# Altium schematic sheet 02_CPU+Connect.SchDoc
size A4; SheetNumber: 3; SheetTotal: 4
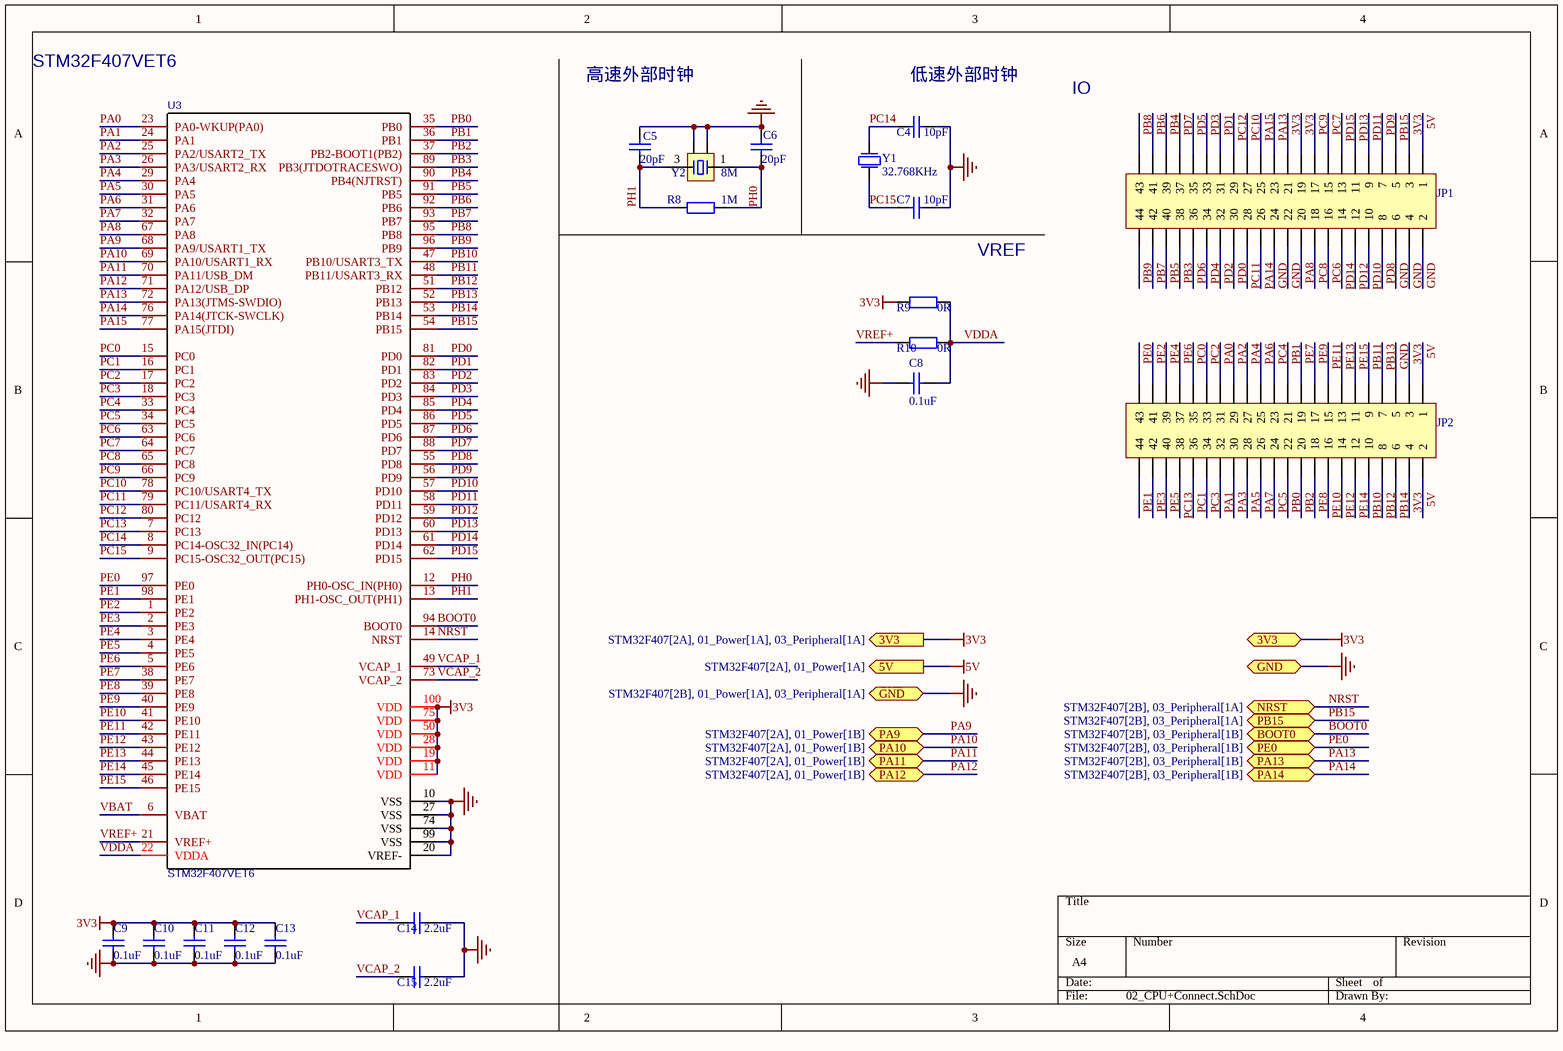
[diagram p0: 02_CPU+Connect.SchDoc]

## Parts
C4  10pF  [C 0402_L]
C5  20pF  [C 0402_L]
C6  20pF  [C 0402_L]
C7  10pF  [C 0402_L]
C8  0.1uF  [C 0402_L]
C9  0.1uF  [C 0402_L]
C10  0.1uF  [C 0402_L]
C11  0.1uF  [C 0402_L]
C12  0.1uF  [C 0402_L]
C13  0.1uF  [C 0402_L]
C14  2.2uF  [C 0402_L]
C15  2.2uF  [C 0402_L]
JP1  Header 2x22  [HDR2.54-LI-2x22P]  (value not drawn)
JP2  Header 2x22  [HDR2.54-LI-2x22P]  (value not drawn)
R8  1M  [R 0402_L]
R9  0R  [R 0402_L]
R10  0R  [R 0402_L]
U3  STM32F407VET6  [LQFP100 14x14_N]
Y1  32.768KHz  [FC135-3.2X1.5]
Y2  8M  [OSC 3225-4P]

## Ports
3V3 (bidir, see STM32F407[2A], 01_Power[1A], 03_Peripheral[1A]), 3V3 (out, see STM32F407[2A], 01_Power[1A], 03_Peripheral[1A]), 5V (out, see STM32F407[2A], 01_Power[1A]), BOOT0 (bidir, see STM32F407[2B], 03_Peripheral[1B]), GND (bidir, see STM32F407[2B], 01_Power[1A], 03_Peripheral[1A]), NRST (bidir, see STM32F407[2B], 03_Peripheral[1A]), PA9 (bidir, see STM32F407[2A], 01_Power[1B]), PA10 (bidir, see STM32F407[2A], 01_Power[1B]), PA11 (bidir, see STM32F407[2A], 01_Power[1B]), PA12 (bidir, see STM32F407[2A], 01_Power[1B]), PA13 (bidir, see STM32F407[2B], 03_Peripheral[1B]), PA14 (bidir, see STM32F407[2B], 03_Peripheral[1B]), PB15 (bidir, see STM32F407[2B], 03_Peripheral[1A]), PE0 (bidir, see STM32F407[2B], 03_Peripheral[1B])

## Nets
3V3: C9.1 C10.1 C11.1 C12.1 C13.1 JP1.3 JP1.19 JP1.21 JP2.3 JP2.4 R9.2 U3.11(VDD) U3.19(VDD) U3.28(VDD) U3.50(VDD) U3.75(VDD) U3.100(VDD) ; port 3V3
5V: JP1.1 JP2.1 JP2.2 ; port 5V
GND: C4.1 C5.1 C6.1 C7.1 C8.1 C9.2 C10.2 C11.2 C12.2 C13.2 C14.1 C15.1 JP1.2 JP1.4 JP1.6 JP1.22 JP1.24 JP2.5 U3.10(VSS) U3.20(VREF-) U3.27(VSS) U3.74(VSS) U3.99(VSS) Y2.2 Y2.4 ; port GND
BOOT0: U3.94(BOOT0) ; port BOOT0
NRST: U3.14(NRST) ; port NRST
PA0: JP2.31 U3.23(PA0-WKUP(PA0))
PA1: JP2.32 U3.24(PA1)
PA2: JP2.29 U3.25(PA2/USART2_TX)
PA3: JP2.30 U3.26(PA3/USART2_RX)
PA4: JP2.27 U3.29(PA4)
PA5: JP2.28 U3.30(PA5)
PA6: JP2.25 U3.31(PA6)
PA7: JP2.26 U3.32(PA7)
PA8: JP1.20 U3.67(PA8)
PA9: U3.68(PA9/USART1_TX) ; port PA9
PA10: U3.69(PA10/USART1_RX) ; port PA10
PA11: U3.70(PA11/USB_DM) ; port PA11
PA12: U3.71(PA12/USB_DP) ; port PA12
PA13: JP1.23 U3.72(PA13(JTMS-SWDIO)) ; port PA13
PA14: JP1.26 U3.76(PA14(JTCK-SWCLK)) ; port PA14
PA15: JP1.25 U3.77(PA15(JTDI))
PB0: JP2.22 U3.35(PB0)
PB1: JP2.21 U3.36(PB1)
PB2: JP2.20 U3.37(PB2-BOOT1(PB2))
PB3: JP1.38 U3.89(PB3(JTDOTRACESWO))
PB4: JP1.39 U3.90(PB4(NJTRST))
PB5: JP1.40 U3.91(PB5)
PB6: JP1.41 U3.92(PB6)
PB7: JP1.42 U3.93(PB7)
PB8: JP1.43 U3.95(PB8)
PB9: JP1.44 U3.96(PB9)
PB10: JP2.10 U3.47(PB10/USART3_TX)
PB11: JP2.9 U3.48(PB11/USART3_RX)
PB12: JP2.8 U3.51(PB12)
PB13: JP2.7 U3.52(PB13)
PB14: JP2.6 U3.53(PB14)
PB15: JP1.5 U3.54(PB15) ; port PB15
PC0: JP2.35 U3.15(PC0)
PC1: JP2.36 U3.16(PC1)
PC2: JP2.33 U3.17(PC2)
PC3: JP2.34 U3.18(PC3)
PC4: JP2.23 U3.33(PC4)
PC5: JP2.24 U3.34(PC5)
PC6: JP1.16 U3.63(PC6)
PC7: JP1.15 U3.64(PC7)
PC8: JP1.18 U3.65(PC8)
PC9: JP1.17 U3.66(PC9)
PC10: JP1.27 U3.78(PC10/USART4_TX)
PC11: JP1.28 U3.79(PC11/USART4_RX)
PC12: JP1.29 U3.80(PC12)
PC13: JP2.38 U3.7(PC13)
PC14: C4.2 U3.8(PC14-OSC32_IN(PC14)) Y1.1(P1)
PC15: C7.2 U3.9(PC15-OSC32_OUT(PC15)) Y1.2(P2)
PD0: JP1.30 U3.81(PD0)
PD1: JP1.31 U3.82(PD1)
PD2: JP1.32 U3.83(PD2)
PD3: JP1.33 U3.84(PD3)
PD4: JP1.34 U3.85(PD4)
PD5: JP1.35 U3.86(PD5)
PD6: JP1.36 U3.87(PD6)
PD7: JP1.37 U3.88(PD7)
PD8: JP1.8 U3.55(PD8)
PD9: JP1.7 U3.56(PD9)
PD10: JP1.10 U3.57(PD10)
PD11: JP1.9 U3.58(PD11)
PD12: JP1.12 U3.59(PD12)
PD13: JP1.11 U3.60(PD13)
PD14: JP1.14 U3.61(PD14)
PD15: JP1.13 U3.62(PD15)
PE0: JP2.43 U3.97(PE0) ; port PE0
PE1: JP2.44 U3.98(PE1)
PE2: JP2.41 U3.1(PE2)
PE3: JP2.42 U3.2(PE3)
PE4: JP2.39 U3.3(PE4)
PE5: JP2.40 U3.4(PE5)
PE6: JP2.37 U3.5(PE6)
PE7: JP2.19 U3.38(PE7)
PE8: JP2.18 U3.39(PE8)
PE9: JP2.17 U3.40(PE9)
PE10: JP2.16 U3.41(PE10)
PE11: JP2.15 U3.42(PE11)
PE12: JP2.14 U3.43(PE12)
PE13: JP2.13 U3.44(PE13)
PE14: JP2.12 U3.45(PE14)
PE15: JP2.11 U3.46(PE15)
PH0: C6.2 R8.1 U3.12(PH0-OSC_IN(PH0)) Y2.1
PH1: C5.2 R8.2 U3.13(PH1-OSC_OUT(PH1)) Y2.3
VBAT: U3.6(VBAT)
VCAP_1: C14.2 U3.49(VCAP_1)
VCAP_2: C15.2 U3.73(VCAP_2)
VDDA: C8.2 R9.1 R10.1 U3.22(VDDA)
VREF+: R10.2 U3.21(VREF+)

## Notes on the sheet
- STM32F407VET6
- 高速外部时钟
- (near C4) 低速外部时钟
- IO
- VREF

## Library data of the parts
C4-C15 = Cap
JP1 JP2 = Header 2x22: 2x22P接插件; BOM名称: 20*2P接插件
R8-R10 = Res
U3 = STM32F407VET6: BOM_Manufacturer: ST; subpart_no: 1; tags: STM32; BOM_Supplier Part: C28730; BOM_Supplier: LCSC; BOM_Manufacturer Part: STM32F407VET6; image: http://image.lceda.cn/szlcsc/C28730.jpg; spicePre: U; spiceSymbolName: STM32F407VET6
Y1 = XTAL-2P: vaule: 32.768KHz
Y2 = XTAL-4P: 4脚无源晶振; 负载电容: CL20pF; BOM名称: 4脚无源晶振